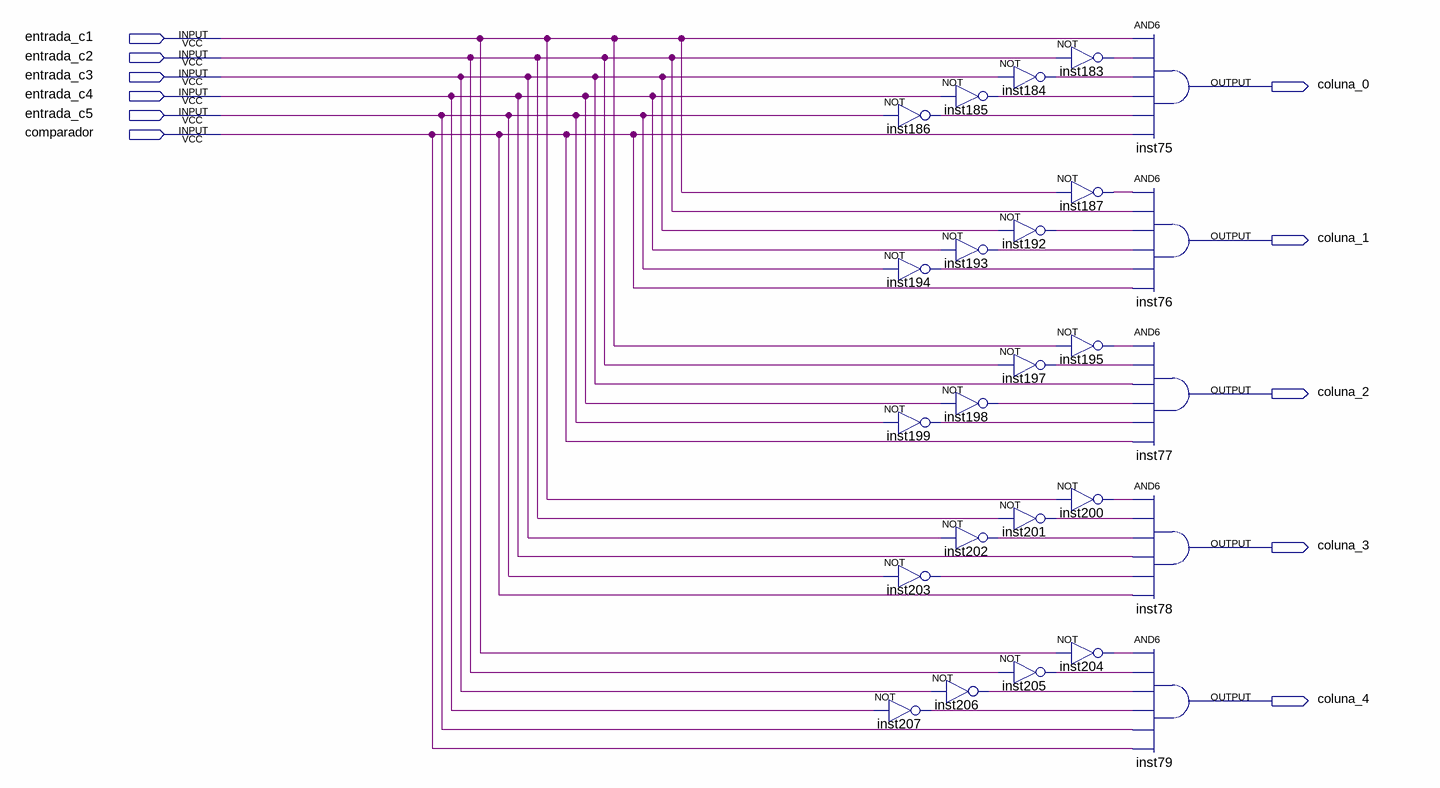
[diagram p0: schematic sheet]
// Quartus schematic decodificador12bits_colunas.bdf as structural Verilog: 25 symbols, 11 pins
module decodificador12bits_colunas (
  input  entrada_c1,
  input  entrada_c2,
  input  entrada_c3,
  input  entrada_c4,
  input  entrada_c5,
  input  comparador,
  output coluna_0,
  output coluna_1,
  output coluna_2,
  output coluna_3,
  output coluna_4
);

  wire inst183_out, inst184_out, inst185_out, inst186_out, inst187_out, inst192_out, inst193_out,
       inst194_out, inst195_out, inst197_out, inst198_out, inst199_out, inst200_out, inst201_out,
       inst202_out, inst203_out, inst204_out, inst205_out, inst206_out, inst207_out;

  not inst207 (inst207_out, entrada_c4);
  not inst185 (inst185_out, entrada_c4);
  not inst186 (inst186_out, entrada_c5);
  not inst193 (inst193_out, entrada_c4);
  not inst194 (inst194_out, entrada_c5);
  not inst198 (inst198_out, entrada_c4);
  not inst199 (inst199_out, entrada_c5);
  not inst202 (inst202_out, entrada_c3);
  not inst203 (inst203_out, entrada_c5);
  not inst206 (inst206_out, entrada_c3);
  not inst184 (inst184_out, entrada_c3);
  not inst192 (inst192_out, entrada_c3);
  not inst197 (inst197_out, entrada_c2);
  not inst201 (inst201_out, entrada_c2);
  not inst205 (inst205_out, entrada_c2);
  not inst183 (inst183_out, entrada_c2);
  not inst187 (inst187_out, entrada_c1);
  not inst195 (inst195_out, entrada_c1);
  not inst200 (inst200_out, entrada_c1);
  not inst204 (inst204_out, entrada_c1);
  and inst75 (coluna_0, entrada_c1, inst183_out, inst184_out, inst185_out, inst186_out, comparador);
  and inst76 (coluna_1, inst187_out, entrada_c2, inst192_out, inst193_out, inst194_out, comparador);
  and inst77 (coluna_2, inst195_out, inst197_out, entrada_c3, inst198_out, inst199_out, comparador);
  and inst78 (coluna_3, inst200_out, inst201_out, inst202_out, entrada_c4, inst203_out, comparador);
  and inst79 (coluna_4, inst204_out, inst205_out, inst206_out, inst207_out, entrada_c5, comparador);
endmodule
